# EAGLE schematic Regulator board_V1.0 (EAGLE 7.7.0)
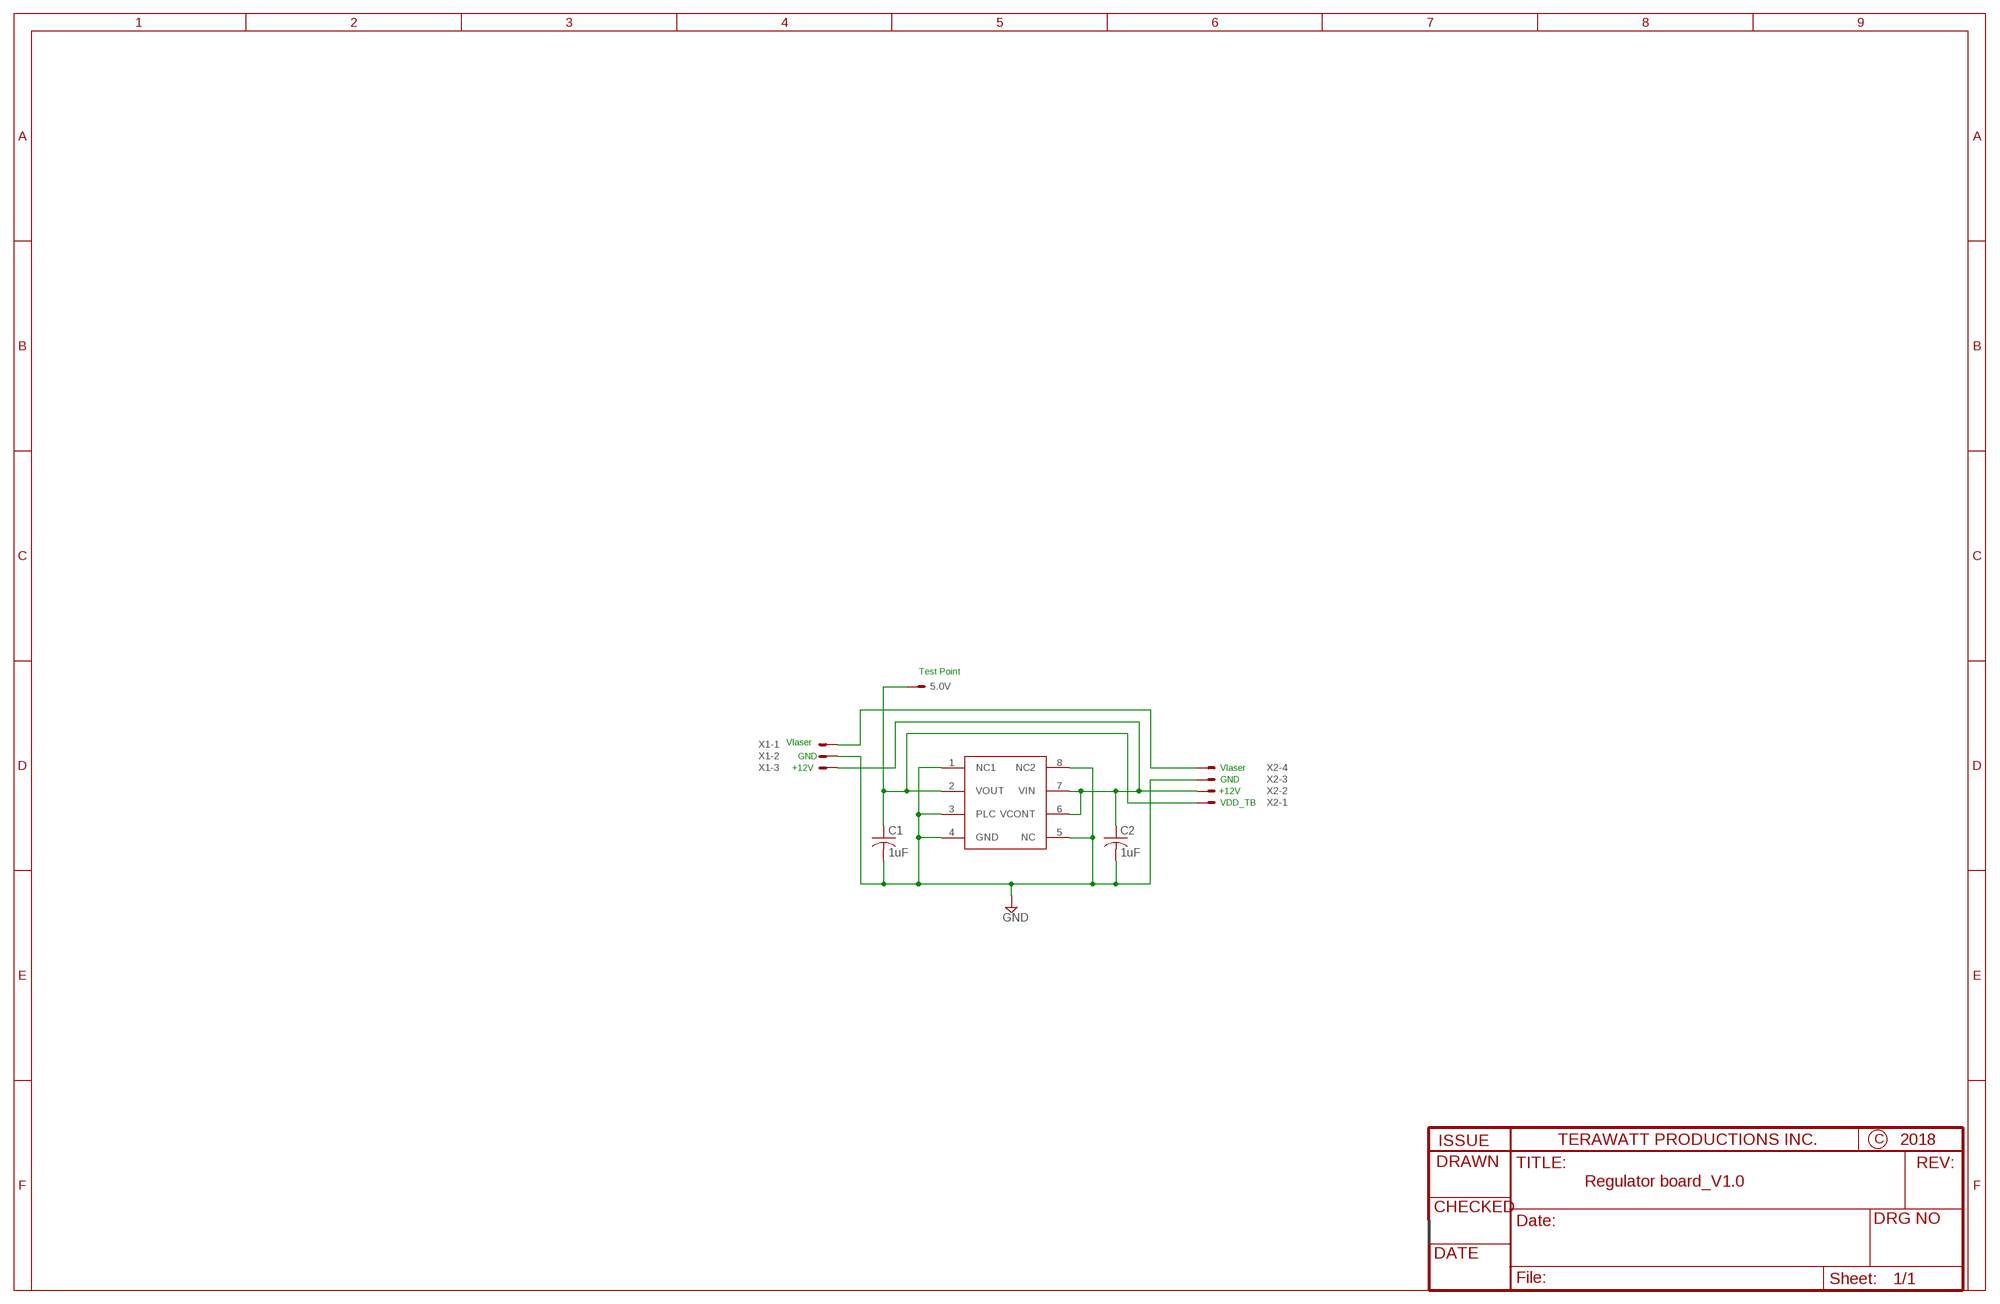
[diagram p0: schematic, sheet 1]

## Parts
5.0V  CONTACT-2MM  [CONTACT-2MM]
C1  1uF  C-USC0805  [C0805]
C2  1uF  C-USC0805  [C0805]
U2  VOLTAGE_REG_APD1154ADL  [SOIC8]
X1  22-23-2031  [22-23-2031]
X2  22-23-2041  [22-23-2041]

## Nets
GND: C1.2 C2.2 U2.1(NC1) U2.3(PLC) U2.4(GND) U2.5(NC) U2.8(NC2) X1.2 X2.3
N$1: X1.1 X2.4
N$2: C2.1 U2.6(VCONT) U2.7(VIN) X1.3 X2.2
N$4: 5.0V.1(S) C1.1 U2.2(VOUT) X2.1

## Notes on the sheet
- Test Point
- Vlaser
- GND
- +12V | Vlaser
- GND
- +12V
- VDD_TB

## Library data of the parts
5.0V = Mine:CONTACT-2MM: contact
C1 C2 = adafruit:C-US: CAPACITOR, American symbol
U2 = Mine:VOLTAGE_REG_APD1154ADL: 3.3 or 5.0 , 1A voltage regulator, SOIC8 package
X1 = Mine:22-23-2031: .100" (2.54mm) Center Header - 3 Pin; MF: MOLEX; MPN: 22-23-2031; OC_FARNELL: 1462950; OC_NEWARK: 30C0862
X2 = Mine:22-23-2041: .100" (2.54mm) Center Header - 4 Pin; MF: MOLEX; MPN: 22-23-2041; OC_FARNELL: 1462920; OC_NEWARK: 38C0355